# EAGLE design Robot-Controller_v11 (EAGLE 6.6.0)
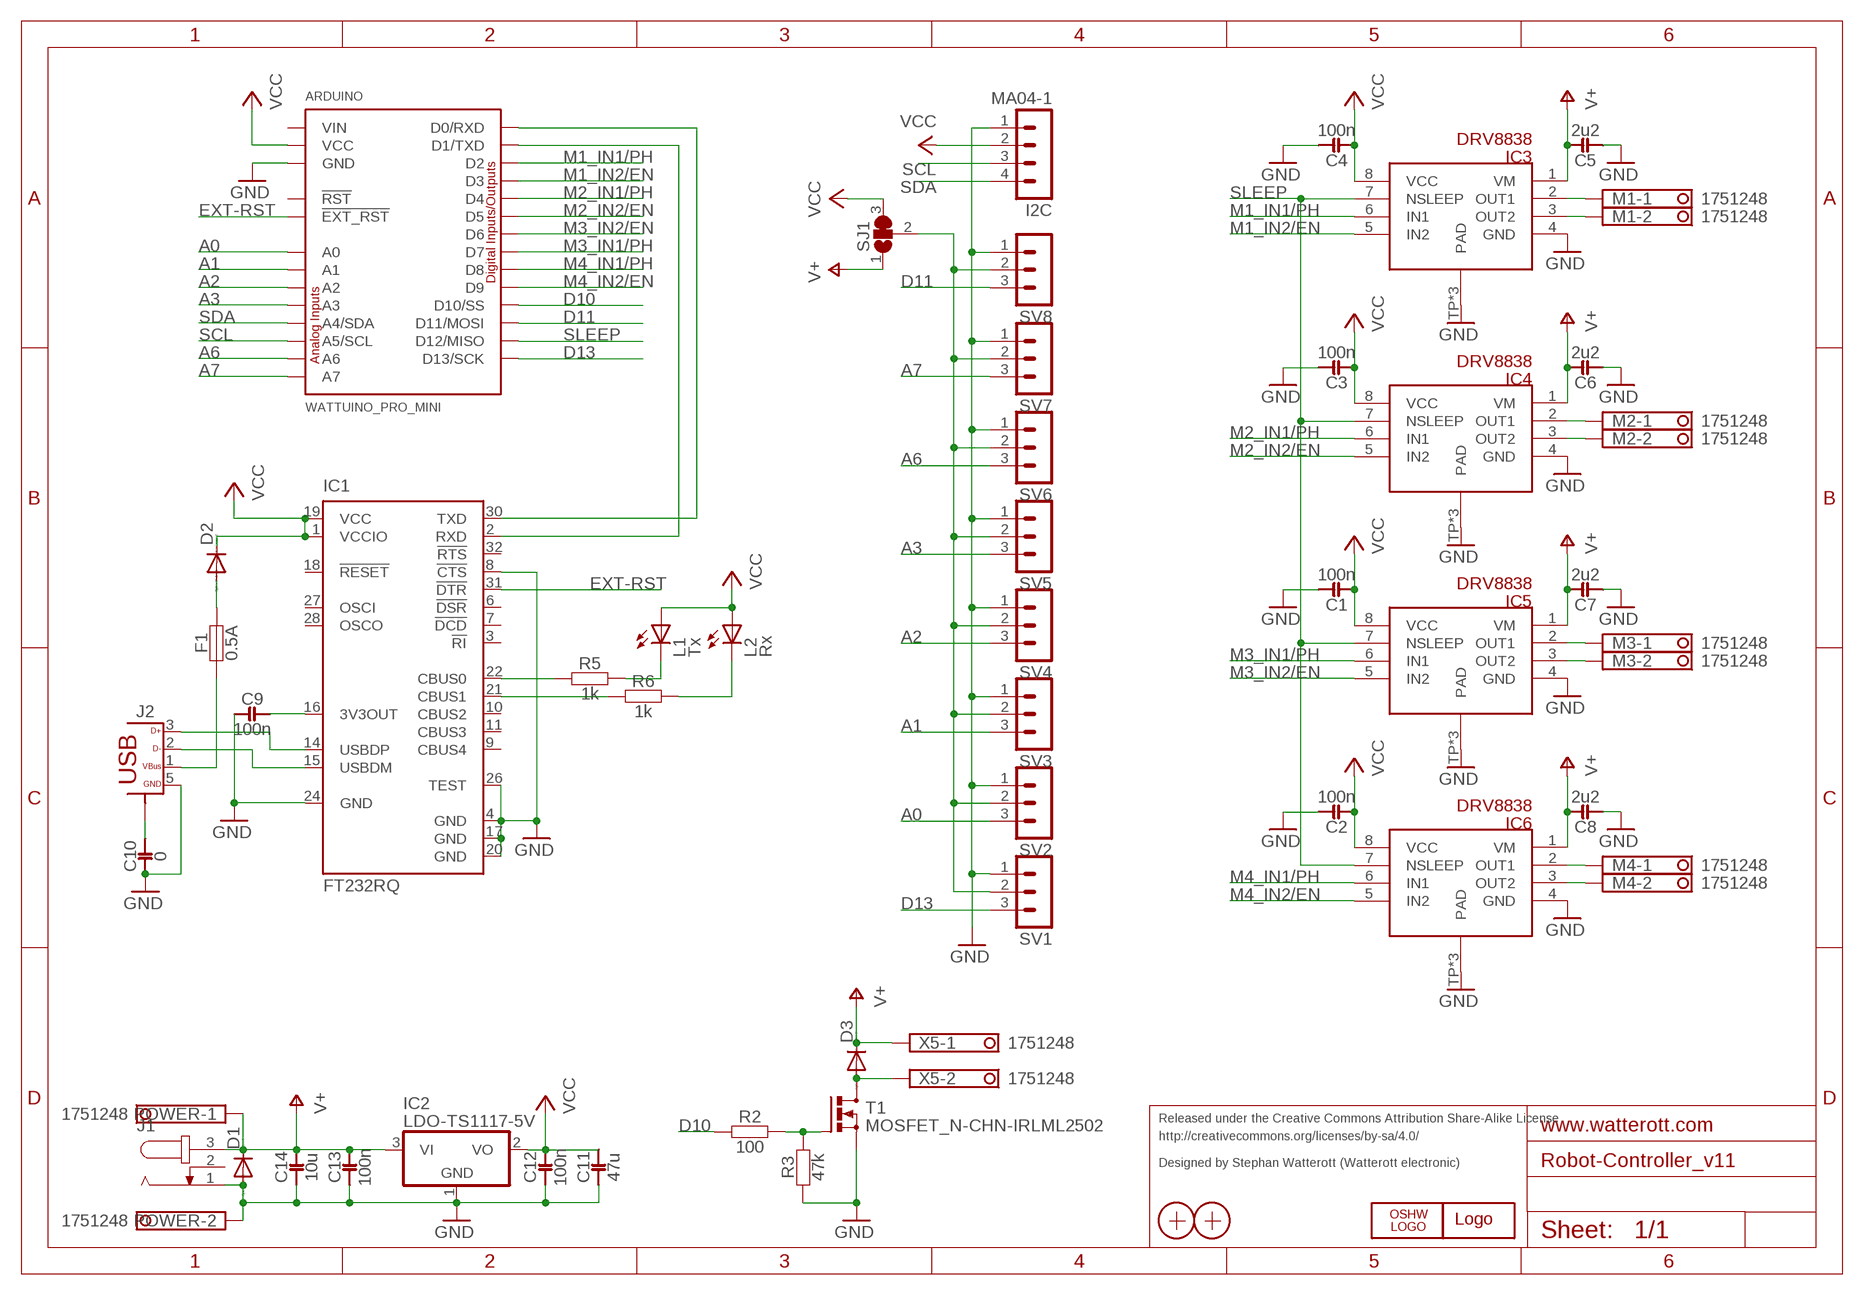
[diagram p0: schematic, sheet 1]

## Parts
ARDUINO  WATTUINO_PRO_MINI  WATTUINO_PRO_MINI5ADV1.0  [WATTUINO_PRO_MINI]
C1  100n  CAPACITOR-C0603  [R0603]
C2  100n  CAPACITOR-C0603  [R0603]
C3  100n  CAPACITOR-C0603  [R0603]
C4  100n  CAPACITOR-C0603  [R0603]
C5  2u2  CAPACITOR-C0603  [R0603]
C6  2u2  CAPACITOR-C0603  [R0603]
C7  2u2  CAPACITOR-C0603  [R0603]
C8  2u2  CAPACITOR-C0603  [R0603]
C9  100n  CAPACITOR-C0603  [R0603]
C10  0  CAPACITOR-C0603  [R0603]
C11  47u  CAPACITOR-C1206  [R1206]
C12  100n  CAPACITOR-C0603  [R0603]
C13  100n  CAPACITOR-C0603  [R0603]
C14  10u  CAPACITOR-C1206  [R1206]
D1  CGRM4001-G  [SOD-123_MINI-SMA]
D2  CGRM4001-G  [SOD-123_MINI-SMA]
D3  CGRM4001-G  [SOD-123_MINI-SMA]
F1  0.5A  RESISTOR-R0805  [R0805]
I2C  MA04-1  [MA04-1]
IC1  FT232RQ  [QFN32]
IC2  LDO-TS1117-5V  LDO-TS1117  [SOT223]
IC3  DRV8838  DRV8837  [WSON8]
IC4  DRV8838  DRV8837  [WSON8]
IC5  DRV8838  DRV8837  [WSON8]
IC6  DRV8838  DRV8837  [WSON8]
J1  DC-JACK""  [DC-JACK]
J2  USB10103594-0001LF  [10103594]
L1  Tx  LED-0603  [LED_0603]
L2  Rx  LED-0603  [LED_0603]
LOGO2  OSHW_LOGOX0100  [OSHW_6X100]
LOGO3  LOGO-SPARK_PLACE  [SPARK_TPLACE]
M1  1751248  [1751248]
M2  1751248  [1751248]
M3  1751248  [1751248]
M4  1751248  [1751248]
POWER  1751248  [1751248]
R2  100  RESISTOR-R0603  [R0603]
R3  47k  RESISTOR-R0603  [R0603]
R5  1k  RESISTOR-R0603  [R0603]
R6  1k  RESISTOR-R0603  [R0603]
SJ1  SJ2W  [SJ_2]
SV1  MA03-1  [MA03-1]
SV2  MA03-1  [MA03-1]
SV3  MA03-1  [MA03-1]
SV4  MA03-1  [MA03-1]
SV5  MA03-1  [MA03-1]
SV6  MA03-1  [MA03-1]
SV7  MA03-1  [MA03-1]
SV8  MA03-1  [MA03-1]
T1  MOSFET_N-CHN-IRLML2502  [SOT23]
X1  PASSER-07  [PASSER_07MM]
X2  PASSER-07  [PASSER_07MM]
X5  1751248  [1751248]

## Nets
A0: ARDUINO.A0 SV2.3
A1: ARDUINO.A1 SV3.3
A2: ARDUINO.A2 SV4.3
A3: ARDUINO.A3 SV5.3
A6: ARDUINO.A6 SV6.3
A7: ARDUINO.A7 SV7.3
D10: ARDUINO.10(D10/SS) R2.1
D11: ARDUINO.11(D11/MOSI) SV8.3
D13: ARDUINO.13(D13/SCK) SV1.3
EXT-RST: ARDUINO.EXT_RST(!EXT_RST) IC1.31(!DTR)
GND: ARDUINO.GND@1(GND) C1.2 C2.2 C3.2 C4.2 C5.1 C6.1 C7.1 C8.1 C9.1 C10.1 C11.1 C12.1 C13.1 C14.1 D1.A I2C.1 IC1.4(GND) IC1.8(!CTS) IC1.17(GND) IC1.20(GND) IC1.24(GND) IC1.26(TEST) IC2.1(GND) IC3.4(GND) IC3.TP1(PAD) IC3.TP2(PAD) IC3.TP(PAD) IC4.4(GND) IC4.TP1(PAD) IC4.TP2(PAD) IC4.TP(PAD) IC5.4(GND) IC5.TP1(PAD) IC5.TP2(PAD) IC5.TP(PAD) IC6.4(GND) IC6.TP1(PAD) IC6.TP2(PAD) IC6.TP(PAD) J1.1 J2.5(GND) POWER.2 R3.1 SV1.1 SV2.1 SV3.1 SV4.1 SV5.1 SV6.1 SV7.1 SV8.1 T1.2(S)
M1_IN1/PH: ARDUINO.2(D2) IC3.6(IN1)
M1_IN2/EN: ARDUINO.3(D3) IC3.5(IN2)
M2_IN1/PH: ARDUINO.4(D4) IC4.6(IN1)
M2_IN2/EN: ARDUINO.5(D5) IC4.5(IN2)
M3_IN1/PH: ARDUINO.7(D7) IC5.6(IN1)
M3_IN2/EN: ARDUINO.6(D6) IC5.5(IN2)
M4_IN1/PH: ARDUINO.8(D8) IC6.6(IN1)
M4_IN2/EN: ARDUINO.9(D9) IC6.5(IN2)
N$1: IC3.2(OUT1) M1.1
N$2: IC3.3(OUT2) M1.2
N$3: IC4.2(OUT1) M2.1
N$4: IC4.3(OUT2) M2.2
N$5: IC5.2(OUT1) M3.1
N$6: IC5.3(OUT2) M3.2
N$7: IC6.2(OUT1) M4.1
N$8: IC6.3(OUT2) M4.2
N$9: F1.1 J2.1(VBUS)
N$10: IC1.15(USBDM) J2.2(D-)
N$11: R2.2 R3.2 T1.1(G)
N$12: C9.2 IC1.16(3V3OUT)
N$13: ARDUINO.RXD@1(D0/RXD) IC1.30(TXD)
N$14: D3.A T1.3(D) X5.2
N$15: IC1.14(USBDP) J2.3(D+)
N$16: ARDUINO.TXD@1(D1/TXD) IC1.2(RXD)
N$17: IC1.22(CBUS0) R5.1
N$18: IC1.21(CBUS1) R6.1
N$19: SJ1.2 SV1.2 SV2.2 SV3.2 SV4.2 SV5.2 SV6.2 SV7.2 SV8.2
N$20: C10.2 J2.P$6(SHIELD) J2.P$7(SHIELD)
N$21: D2.A F1.2
N$22: L1.C R5.2
N$23: L2.C R6.2
SCL: ARDUINO.A5(A5/SCL) I2C.3
SDA: ARDUINO.A4(A4/SDA) I2C.4
SLEEP: ARDUINO.12(D12/MISO) IC3.7(NSLEEP) IC4.7(NSLEEP) IC5.7(NSLEEP) IC6.7(NSLEEP)
V+: C5.2 C6.2 C7.2 C8.2 C13.2 C14.2 D1.C D3.C IC2.3(VI) IC3.1(VM) IC4.1(VM) IC5.1(VM) IC6.1(VM) J1.3 POWER.1 SJ1.1 X5.1
VCC: ARDUINO.VCC@1(VCC) C1.1 C2.1 C3.1 C4.1 C11.2 C12.2 D2.C I2C.2 IC1.1(VCCIO) IC1.19(VCC) IC2.2(VO) IC3.8(VCC) IC4.8(VCC) IC5.8(VCC) IC6.8(VCC) L1.A L2.A SJ1.3
Unconnected: ARDUINO.RST@1(!RST) IC1.3(!RI) IC1.6(!DSR) IC1.7(!DCD) IC1.9(CBUS4) IC1.10(CBUS2) IC1.11(CBUS3) IC1.18(!RESET) IC1.27(OSCI) IC1.28(OSCO) IC1.32(!RTS) J1.2

## Notes on the sheet
- Released under the Creative Commons Attribution Share-Alike License
- http://creativecommons.org/licenses/by-sa/4.0/
- Designed by Stephan Watterott (Watterott electronic)

## Power pins joined to a net without a drawn wire
VIN: ARDUINO.VIN

## Library data of the parts
ARDUINO = wattuino:WATTUINO_PRO_MINI: Wattuino Pro Mini Arduino compatible module, available as 5V / 16MHz <http://www.watterott.com/en/Wattuino-pro-mini-5V-16MHz> and 3.3V / 8MHz <http://www.watterott.com/en/Wattuino-pro-mini-3V3-8MHz> versions from Watterott electronic <http://www.watterott.com>. Source: https://github.com/watterott/wattuino Features Atmel AVR ATmega328P @ 16MHz or 8MHz (external resonator) Compatible with Arduino Pro Mini LC filter on AVCC of the AVR microcontroller All pins of the AVR are available (also ADC6, ADC7) USB connection off board 5V or 3V3 voltage regulator Over current protected Note to the symbol: I declared the EXT_RST pin as I/O even it is an input only. Usually this pin is unused. Declared as input only, the ERC check would complain an unconnected input in this common case. This work is licensed under a Creative Commons Attribution-ShareAlike 3.0 Unported License <http://creativecommons.org/licenses/by-sa/3.0/>. Created by Jens Bachmann; CLOCK: 16 MHz; VCC: 5 V
C1-C14 = we-rcl:CAPACITOR
D1-D3 = diode:CGRM400*-G: Molded plasitc,JEDEC SOD-123/Mini SMA Source: Comchip CGRM4001-G.pdf
F1 R2 R3 R5 R6 = we-rcl:RESISTOR
I2C = we-con:MA04-1: PIN HEADER; OC_FARNELL: unknown; OC_NEWARK: unknown
IC1 = ftdichip:FT232R: Source: http://www.ftdichip.com/Documents/DataSheets/DS_FT232R_v104.pdf; MPN: FT232RQ; OC_FARNELL: 1146033; OC_NEWARK: 91K9919
IC2 = we-power:LDO
IC3-IC6 = we-chip:DRV8837
J1 = we-power:DC-JACK
J2 = we-con:USB: USB Connectors
L1 L2 = we-opto:LED
LOGO2 = we-symbol:OSHW_LOGO
LOGO3 = we-symbol:LOGO
M1-M4 POWER X5 = con-phoenix-350:1751248: MKDS 1/ 2-3,5 Printklemme Nennstrom: 10 A Bemessungsspannung: 160 V Raster: 3,5 mm Polzahl: 2 Montageart: Löten Anschlussart: Schraubanschluss Anschlussrichtung vom Leiter zur Platine: 0° Source: http://eshop.phoenixcontact.com .. 1751248.pdf; OC_FARNELL: unknown; OC_NEWARK: unknown
SJ1 = jumper:SJ2W: SMD solder JUMPER
SV1-SV8 = con-lstb:MA03-1: PIN HEADER; OC_FARNELL: unknown; OC_NEWARK: unknown
T1 = we-transistor:MOSFET_N-CHN: N-Channel Power MOSFET
X1 X2 = we-symbol:PASSER

## Board
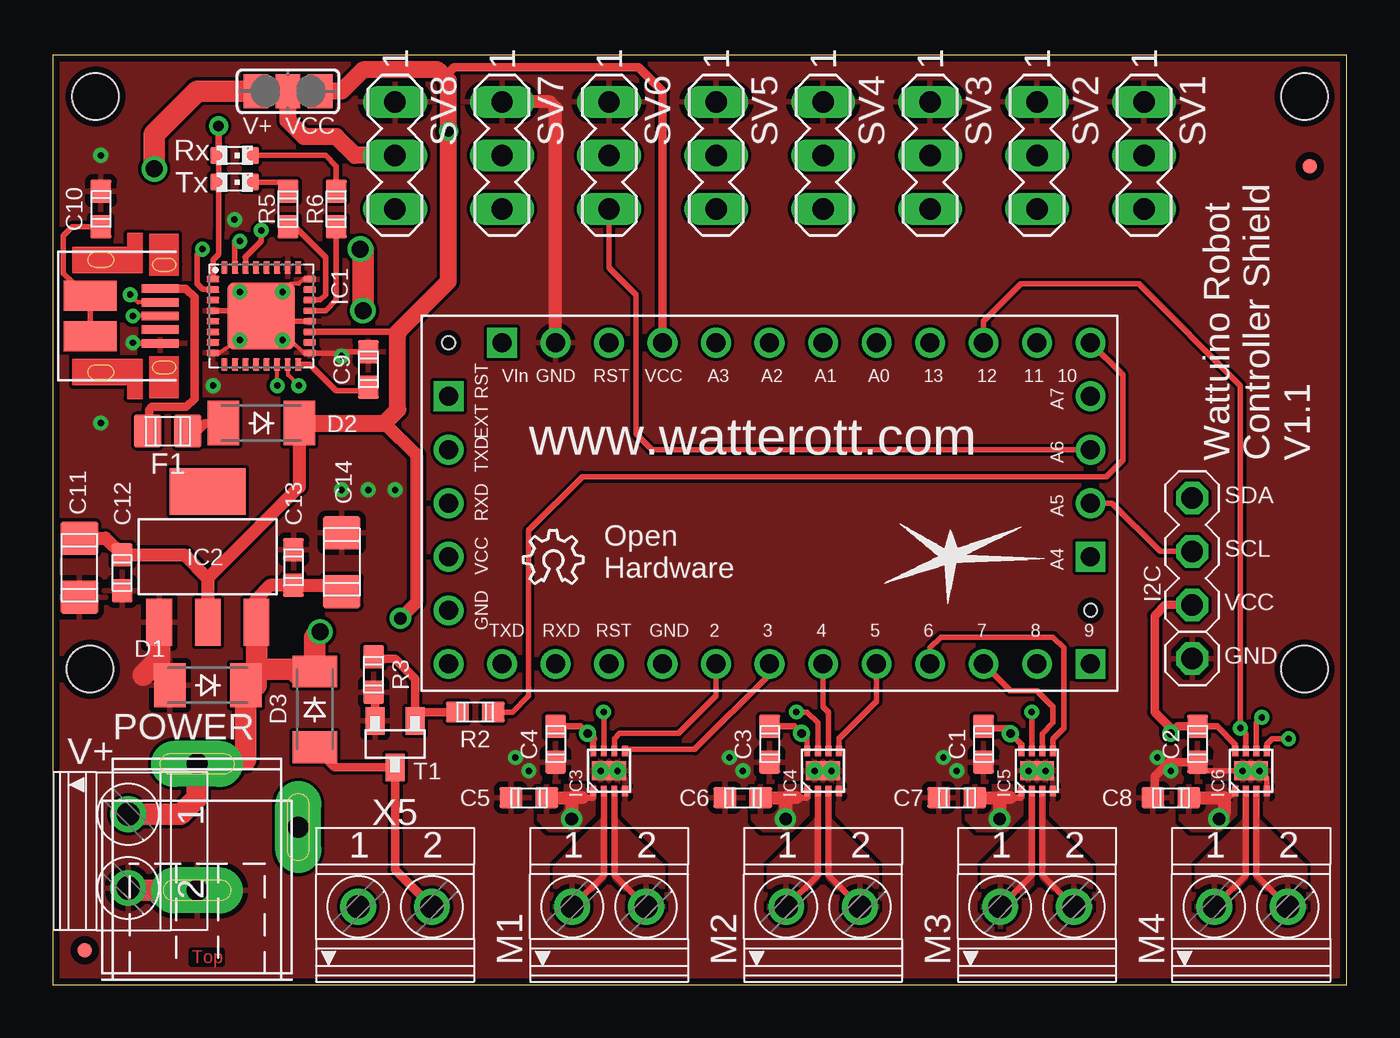
[diagram p1: board, top side]
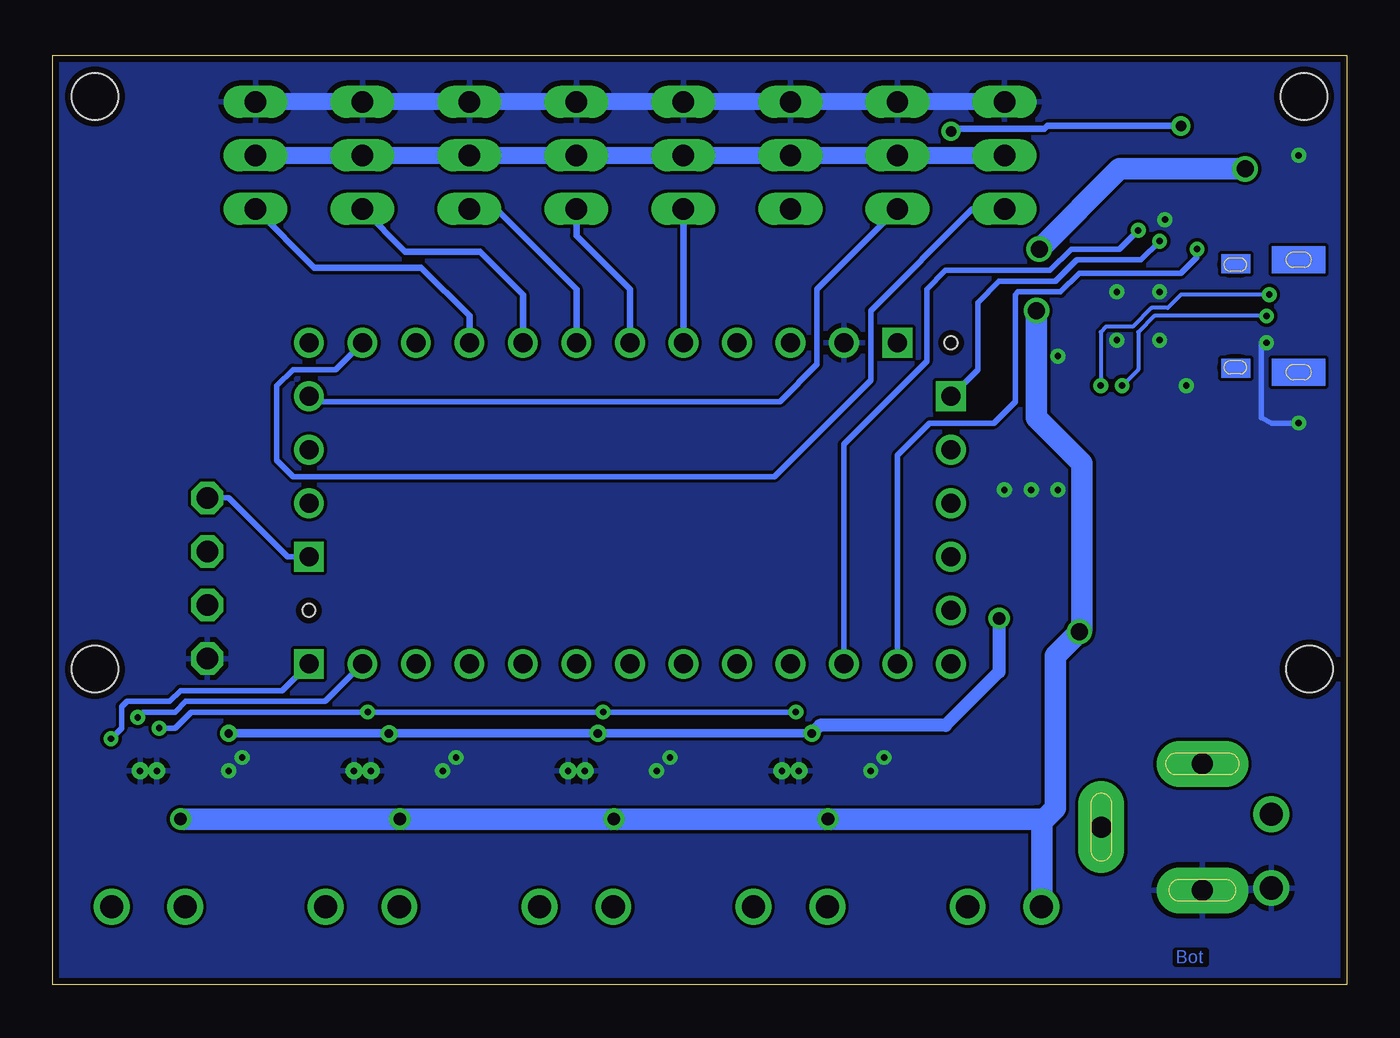
[diagram p2: board, bottom side, seen from below]

Size 61.44 x 44.12 mm. Coordinates in mm from the lower left corner, seen from the top.
Outline: 0,0 61.44,0 61.44,44.12 0,44.12 0,0
Copper layers (1*16): Top 0.035mm / dielectric 1.5mm / Bottom 0.035mm
Design rules "default *": minimum track width 6mil, minimum drill 0.29mm, track to track 6mil, track to pad 6mil, pad to pad 6mil, via to via 6mil, smd to smd 6mil, copper to edge 12mil, drill to drill 8mil, minimum pad ring 10mil, minimum via ring 8mil, stop-mask expansion 4mil, vias tented up to drill 0.8mm, thermal gap 10mil
Holes 2.2 mm at 2.03,42.16 1.78,14.99 59.44,14.99 59.44,42.16

### Footprints (pad centres in the part's own frame; a part is rotated, then mirrored left to right if it is on the bottom)
WATTUINO_PRO_MINI = drill 0.9: 2 -2.54,-7.62; 3 0,-7.62; 4 2.54,-7.62; 5 5.08,-7.62; 6 7.62,-7.62; 7 10.16,-7.62; 8 12.7,-7.62; 10 15.24,7.62; 11 12.7,7.62; 12 10.16,7.62; 13 7.62,7.62; A0 5.08,7.62; A1 2.54,7.62; A2 0,7.62; A3 -2.54,7.62; A5 15.24,0; A6 15.24,2.54; A7 15.24,5.08; GND@1 -10.16,7.62; GND@2 -5.08,-7.62; GND@3 -15.24,-7.62; GND@4 -15.24,-5.08; RST@1 -7.62,7.62; RST@2 -7.62,-7.62; RXD@1 -10.16,-7.62; RXD@2 -15.24,0; TXD@1 -12.7,-7.62; TXD@2 -15.24,2.54; VCC@1 -5.08,7.62; VCC@2 -15.24,-2.54 | drill 0.9 square: 9 15.24,-7.62; A4 15.24,-2.54; EXT_RST -15.24,5.08; VIN -12.7,7.62 | hole 0.6: -15.24,7.62; 15.24,-5.08
R0603 = smd 1 x 1.1: 1 0,0.85; 2 0,-0.85
R1206 = smd 1.8 x 1.6: 1 0,1.4; 2 0,-1.4
SOD-123_MINI-SMA = smd 1.5 x 2.1: A 1.8,0; C -1.8,0
R0805 = smd 1.55 x 1.3: 1 0,0.95; 2 0,-0.95
MA04-1 = drill 1.016 octagon: 1 0,3.81; 2 0,1.27; 3 0,-1.27; 4 0,-3.81
QFN32 = smd 0.6 x 0.3: 1 -2.3,1.75; 2 -2.3,1.25; 3 -2.3,0.75; 4 -2.3,0.25; 5 -2.3,-0.25; 6 -2.3,-0.75; 7 -2.3,-1.25; 8 -2.3,-1.75; 17 2.3,-1.75; 18 2.3,-1.25; 19 2.3,-0.75; 20 2.3,-0.25; 21 2.3,0.25; 22 2.3,0.75; 23 2.3,1.25; 24 2.3,1.75 | smd 0.3 x 0.6: 9 -1.75,-2.3; 10 -1.25,-2.3; 11 -0.75,-2.3; 12 -0.25,-2.3; 13 0.25,-2.3; 14 0.75,-2.3; 15 1.25,-2.3; 16 1.75,-2.3; 25 1.75,2.3; 26 1.25,2.3; 27 0.75,2.3; 28 0.25,2.3; 29 -0.25,2.3; 30 -0.75,2.3; 31 -1.25,2.3; 32 -1.75,2.3 | smd 3.2 x 3.2: EXP 0,0
SOT223 = smd 2.235 x 1.219: 1 -3.099,2.311; 2 -3.099,0; 3 -3.099,-2.311 | smd 2.2 x 3.6: 4 3.099,0
WSON8 = smd 0.5 x 0.28: 1 -0.95,0.75; 2 -0.95,0.25; 3 -0.95,-0.25; 4 -0.95,-0.75; 5 0.95,-0.75; 6 0.95,-0.25; 7 0.95,0.25; 8 0.95,0.75 | smd 0.9 x 1.6: TP 0,0 | drill 0.3 pad 0.61: TP1 0,0.4; TP2 0,-0.4
DC-JACK = drill 1 pad 2.184 long: 1 -3,0; 2 0,-4.8; 3 3,0
10103594 = smd 0.4 x 1.75: 1 -1.3,2.825; 2 -0.65,2.825; 3 0,2.825; 4 0.65,2.825; 5 1.3,2.825 | smd 1.425 x 2.5: P$6 0.963,-0.5; P$7 -0.963,-0.5
LED_0603 = smd 0.8 x 0.8: A 0,-0.75; C 0,0.75
1751248 = drill 1.1 pad 1.7: 1 -1.75,-0.1; 2 1.75,-0.1
SJ_2 = smd 1.168 x 1.6: 1 -1.524,0; 2 0,0; 3 1.524,0
MA03-1 = drill 1.016 long: 1 -2.54,0; 2 0,0; 3 2.54,0
SOT23 = smd 1.3 x 0.9: 1 -1.1,0.95; 2 -1.1,-0.95; 3 1.1,0
PASSER_07MM = smd 0.7 x 0.7: X 0,0

### Placement (x,y rotation side)
ARDUINO  34.04,22.86 0 top
C1  44.2,11.43 0 top
C2  54.36,11.43 0 top
C3  34.04,11.43 0 top
C4  23.88,11.43 0 top
C5  22.61,8.89 90 top
C6  32.77,8.89 90 top
C7  42.93,8.89 90 top
C8  53.09,8.89 90 top
C9  14.99,29.21 0 top
C10  2.29,36.83 0 top
C11  1.27,19.81 180 top
C12  3.3,19.56 180 top
C13  11.43,19.81 0 top
C14  13.72,20.07 0 top
D1  7.37,14.22 180 top
D2  9.91,26.67 180 top
D3  12.45,13.08 270 top
F1  5.46,26.29 90 top
I2C  54.1,19.3 180 top
IC1  9.91,31.75 0 top
IC2  7.37,20.32 90 top
IC3  26.42,10.16 90 top
IC4  36.58,10.16 90 top
IC5  46.74,10.16 90 top
IC6  56.9,10.16 90 top
J1  6.86,7.49 90 top
J2  2.29,31.75 270 top
L1  8.64,38.1 270 top
L2  8.64,39.37 270 top
LOGO2  22.35,19.05 0 top
LOGO3  42.67,20.32 0 top
M1  26.42,3.81 0 top
M2  36.58,3.81 0 top
M3  46.74,3.81 0 top
M4  56.9,3.81 0 top
POWER  3.68,6.35 270 top
R2  20.07,12.95 270 top
R3  15.24,14.73 180 top
R5  11.18,36.83 180 top
R6  13.46,36.83 180 top
SJ1  11.18,42.42 0 top
SV1  51.82,39.37 270 top
SV2  46.74,39.37 270 top
SV3  41.66,39.37 270 top
SV4  36.58,39.37 270 top
SV5  31.5,39.37 270 top
SV6  26.42,39.37 270 top
SV7  21.34,39.37 270 top
SV8  16.26,39.37 270 top
T1  16.26,11.43 270 top
X1  1.52,1.65 0 top
X2  59.69,38.86 0 top
X5  16.26,3.81 0 top

### Tracks (layer width: path | path; a pad name or v marks a point on that pad's centre or on a via)
A0
  Bottom 0.305: SV2.3 44.7,34.8 41.15,34.8 39.12,32.77 ARDUINO.A0
A1
  Bottom 0.305: SV3.3 40.39,36.83 36.58,33.02 ARDUINO.A1
A2
  Bottom 0.305: SV4.3 36.58,35.56 34.04,33.02 ARDUINO.A2
A3
  Bottom 0.305: SV5.3 ARDUINO.A3
A6
  Top 0.254: SV6.3 26.42,34.04 27.69,32.77 27.69,26.16 28.45,25.4 ARDUINO.A6
A7
  Bottom 0.254: SV7.3 25.15,33.02 25.15,29.46 26.92,27.69 49.02,27.69 ARDUINO.A7
D10
  Top 0.254: R2.1 21.84,12.95 22.61,13.72 22.61,21.59 25.15,24.13 50.04,24.13 50.8,24.89 50.8,28.96 ARDUINO.10
D11
  Bottom 0.254: SV8.3 17.78,36.83 22.61,32 22.61,28.7 27.18,24.13 50.04,24.13 50.8,24.89 50.8,28.45 50.04,29.21 48.01,29.21 ARDUINO.11
D13
  Bottom 0.305: ARDUINO.13 41.66,31.75 43.94,34.04 49.02,34.04 SV1.3 53.09,36.83
EXT-RST  (via drill 0.3)
  Top 0.254: v8.89,35.31 8.64,35.31 8.64,34.07 IC1.31
  Bottom 0.254: v8.89,35.31 9.78,34.42 12.83,34.42 13.84,33.4 16.51,33.4 17.53,32.38 17.53,29.21 ARDUINO.EXT_RST 18.8,28.32
GND  (via drill 0.3)
  Top 0.2: IC1.8 7.9,30 8.64,30.48 | IC1.24 11.91,33.5 11.68,33.27 11.3,33.27 v10.92,32.89 | 11.3,30.61 11.94,29.97 12.19,29.97
  Top 0.254: IC6.4 57.65,9.81 IC6.TP2 IC6.TP IC6.TP1 54.78,10.16 C2.2 | C9.1 13.55,30.06 13.46,29.97 12.23,29.97 IC1.17 | IC1.4 8.89,32 8.64,30.48 | 11.18,31.5 IC1.20 10.93,31.5 10.92,31.5 v10.92,30.61 11.3,30.61 | J2.5 3.59,30.45 v3.81,30.48
  Top 0.305: 12.23,29.97 12.19,29.97
  Top 0.406: C2.2 53,10.58 52.32,9.91 52.32,8.98 C8.1 | T1.2 15.31,13.87 R3.1
  Top 0.61: ARDUINO.GND@1 23.88,41.66 23.62,41.91 SV7.1
  Top 1.016: 4.3,14.71 5.08,15.49 5.08,17.2 IC2.1 | J1.1 3.69,4.49 POWER.2
  Bottom 0.254: v3.81,30.48 4.06,30.48 4.06,26.92 3.56,26.67 v2.29,26.67
  Bottom 0.813: SV8.1 SV7.1 SV6.1 SV5.1 SV4.1 SV3.1 SV2.1 SV1.1
  other vias: 13.72,23.5 14.99,23.5 16.26,23.5 32.13,10.79 32.77,10.16 22.61,10.16 21.97,10.79 42.93,10.16 42.29,10.79 53.09,10.16 52.45,10.79 13.72,29.84 8.64,36.32 2.29,39.37 7.62,28.45 8.89,30.61 8.89,32.89
  pour Top (rank 2): 0.12,0.12 61.34,0.12 61.34,43.69 0.12,43.69
  pour Bottom: 0.12,0.12 61.34,0.12 61.34,43.69 0.12,43.69
M1_IN1/PH
  Top 0.254: ARDUINO.2 31.5,13.72 29.72,11.94 26.92,11.94 26.67,11.68 IC3.6
M1_IN2/EN
  Top 0.254: ARDUINO.3 34.04,14.73 30.48,11.18 27.23,11.18 IC3.5
M2_IN1/PH
  Top 0.254: ARDUINO.4 36.58,13.21 36.83,12.95 IC4.6
M2_IN2/EN
  Top 0.254: ARDUINO.5 39.12,13.46 37.34,11.68 37.34,11.12 IC4.5
M3_IN1/PH
  Top 0.254: IC5.6 46.99,11.93 47.5,12.45 47.5,13.21 46.74,13.97 45.47,13.97 ARDUINO.7
M3_IN2/EN
  Top 0.254: IC5.5 47.49,11.67 48.01,12.19 48.01,16 47.5,16.51 42.16,16.51 41.66,16 ARDUINO.6
M4_IN1/PH  (via drill 0.3)
  Top 0.254: IC6.6 57.15,12.44 v57.4,12.7
  Bottom 0.254: ARDUINO.8 48.51,13.46 55.12,13.46 55.63,12.95 57.15,12.95 v57.4,12.7
M4_IN2/EN  (via drill 0.3)
  Top 0.254: IC6.5 57.65,11.42 57.91,11.68 v58.67,11.68
  Bottom 0.254: ARDUINO.9 50.55,13.97 55.37,13.97 55.88,13.46 57.91,13.46 58.17,13.21 58.17,12.19 v58.67,11.68
N$1
  Top 0.305: IC3.2 26.17,5.21 M1.1
  pour Top: 26.16,7.87 23.88,5.59 23.88,3.3 24.13,3.05 25.15,3.05 25.4,3.3 25.4,4.32 26.16,5.08
N$2
  Top 0.305: IC3.3 26.67,5.21 M1.2
  pour Top: 26.67,7.87 26.67,5.08 27.43,4.32 27.43,3.3 27.69,3.05 28.45,3.05 28.96,3.56 28.96,5.59
N$3
  Top 0.305: IC4.2 36.33,5.21 M2.1
  pour Top: 36.32,7.87 34.04,5.59 34.04,3.3 34.29,3.05 35.31,3.05 35.56,3.3 35.56,4.32 36.32,5.08
N$4
  Top 0.305: IC4.3 36.83,5.21 M2.2
  pour Top: 36.83,7.87 36.83,5.08 37.59,4.32 37.59,3.3 37.85,3.05 38.61,3.05 39.12,3.56 39.12,5.59
N$5
  Top 0.305: IC5.2 46.49,5.21 M3.1
  pour Top: 46.48,7.87 44.2,5.59 44.2,3.05 44.45,2.79 45.47,2.79 45.72,3.05 45.72,4.06 46.48,4.83
N$6
  Top 0.305: IC5.3 46.99,5.21 M3.2
  pour Top: 46.99,7.87 46.99,5.08 47.75,4.32 47.75,3.3 48.01,3.05 48.77,3.05 49.28,3.56 49.28,5.59
N$7
  Top 0.305: IC6.2 56.65,5.21 M4.1
  pour Top: 56.64,7.87 54.36,5.59 54.36,3.3 54.61,3.05 55.63,3.05 55.88,3.3 55.88,4.32 56.64,5.08
N$8
  Top 0.305: IC6.3 57.15,5.21 M4.2
  pour Top: 57.15,7.87 57.15,5.08 57.91,4.32 57.91,3.3 58.17,3.05 58.93,3.05 59.44,3.56 59.44,5.59
N$9
  Top 0.2: 4.57,26.35 F1.1
  Top 0.406: J2.1 6.32,33.05 6.73,32.64 6.73,27.81 6.35,27.43 4.7,27.43 4.57,27.3 4.57,26.35
N$10  (via drill 0.3)
  Top 0.2: v11.68,28.45 11.18,28.96 11.18,29.43 IC1.15 | J2.2 4.05,32.4 v3.68,32.77
  Bottom 0.2: v11.68,28.45 11.68,30.99 11.43,31.24 10.16,31.24 9.27,32.13 8.51,32.13 7.87,32.77 v3.68,32.77
N$11
  Top 0.406: R3.2 15.33,15.49 16.26,15.49 17.21,14.54 T1.1 17.63,12.95 R2.2
N$12
  Top 0.254: IC1.16 12.21,29.45 13.46,28.19 14.82,28.19 C9.2
N$13  (via drill 0.3)
  Top 0.254: v9.91,35.81 9.91,35.31 9.14,34.54 9.16,34.53 IC1.30
  Bottom 0.254: ARDUINO.RXD@1 23.88,25.65 19.94,29.59 19.94,33.02 19.05,33.91 14.1,33.91 13.08,34.92 10.79,34.92 v9.91,35.81
N$14
  Top 0.406: X5.2 16.26,5.46 T1.3 13.4,10.33 D3.A
N$15  (via drill 0.3)
  Top 0.2: J2.3 v3.81,31.75 | v10.67,28.45 10.67,29.44 IC1.14
  Bottom 0.2: v3.81,31.75 9.14,31.75 9.91,30.99 9.91,29.21 v10.67,28.45
N$16  (via drill 0.3)
  Top 0.254: IC1.2 7.59,33.02 7.11,33.02 6.86,33.27 6.86,34.67 v7.11,34.92
  Bottom 0.254: ARDUINO.TXD@1 21.34,25.15 19.81,26.67 16.76,26.67 15.75,27.69 15.75,32.77 15.62,32.89 13.59,32.89 12.7,33.78 7.87,33.78 7.11,34.54 v7.11,34.92
N$17
  Top 0.254: R5.1 11.52,35.98 12.95,34.54 12.95,32.77 12.7,32.51 12.22,32.51 IC1.22
N$18
  Top 0.254: R6.1 13.46,32.51 12.95,32 IC1.21
N$19
  Top 0.813: SV8.2 14.35,39.37 13.46,40.26 11.94,40.26 11.18,41.02 SJ1.2
  Bottom 0.813: SV1.2 SV2.2 SV3.2 SV4.2 SV5.2 SV6.2 SV7.2 SV8.2
N$20
  Top 0.254: C10.2 0.93,35.98 0.51,35.56 0.51,33.78 1.02,33.27 1.22,33.27 J2.P$7 J2.P$6
N$21
  Top 0.406: F1.2 6.86,26.29 7.24,26.67 D2.A
N$22
  Top 0.254: L1.C 10.76,38.1 R5.2
N$23
  Top 0.254: L2.C 12.95,39.37 13.46,38.86 R6.2
SCL
  Top 0.254: ARDUINO.A5 50.29,22.86 52.58,20.57 I2C.3
SDA
  Bottom 0.254: I2C.4 53.09,23.11 50.29,20.32 ARDUINO.A4
SLEEP  (via drill 0.3)
  Top 0.254: IC6.7 56.65,11.93 v56.39,12.19 56.39,28.45 51.56,33.27 45.97,33.27 44.2,31.5 ARDUINO.12 | IC5.7 v46.49,12.95 v46.48,12.95 | IC4.7 36.33,12.44 35.81,12.95 v35.31,12.95 | IC3.7 v26.17,12.95 v26.16,12.95
  Bottom 0.254: v56.39,12.19 55.63,12.19 54.86,12.95 v46.48,12.95 v35.31,12.95 v26.16,12.95
V+  (via drill 0.6, 0.8)
  Top 0.305: 55.63,8.89 55.83,8.89 IC6.1 | IC5.1 45.99,8.9 45.97,8.89 45.47,8.89 | IC4.1 35.83,8.9 35.81,8.89 35.31,8.89 | IC3.1 25.67,8.9 25.65,8.89 25.15,8.89
  Top 0.61: C8.2 55.63,8.89 55.63,8.13 v55.37,7.87 | C7.2 44.96,8.89 | 45.47,8.89 44.96,8.89 | 44.96,8.89 v44.96,7.87 | C6.2 34.8,8.89 | 35.31,8.89 34.8,8.89 | 34.8,8.89 v34.8,7.87 | C5.2 24.64,8.89 | 25.15,8.89 24.64,8.89 | 24.64,8.89 v24.64,7.87 | IC2.3 9.65,17.25 9.65,18.29 10.33,18.96 C13.2 13.42,18.96 C14.2
  Top 1.016: IC2.3 9.68,15.01 | 9.68,15.01 9.68,14.99 11.43,14.99 11.68,14.73 12.3,14.73 D3.C 12.45,16.51 v12.7,16.76 | 9.68,15.01 9.65,14.22 D1.C 9.17,10.69 7.11,10.67 6.91,10.54 J1.3 6.86,8.89 6.07,8.1 POWER.1 | SJ1.1 6.86,42.42 4.83,40.39 v4.83,38.73 | v14.61,34.92 14.73,34.92 v14.73,32
  Bottom 1.016: v55.37,7.87 v44.96,7.87 v34.8,7.87 v24.64,7.87 14.73,7.87 | 14.73,7.87 14.48,7.62 14.48,3.74 X5.1 | 14.73,7.87 14.35,7.87 13.84,8.38 13.84,15.62 v12.7,16.76 12.57,16.89 12.57,24.77 14.73,26.92 v14.73,32 | v4.83,38.73 10.79,38.73 v14.61,34.92
  pour Top: 23.11,9.4 25.65,9.4 25.65,8.13 24.89,7.37 23.62,7.37 23.11,7.87
  pour Top: 33.27,9.4 35.81,9.4 35.81,8.13 35.05,7.37 33.78,7.37 33.27,7.87
  pour Top: 43.43,9.4 45.97,9.4 45.97,8.13 45.21,7.37 43.94,7.37 43.43,7.87
  pour Top: 53.59,9.4 56.13,9.4 56.13,8.13 55.37,7.37 54.1,7.37 53.59,7.87
VCC  (via drill 0.4, 0.5, 0.6)
  Top 0.254: IC1.1 7.62,33.51 7.62,34.42 7.87,34.67 7.87,35.81 7.89,35.83 L1.A L2.A | 35.81,11.12 35.81,11.68 v35.56,11.94 35.22,12.28
  Top 0.305: IC6.8 56.13,11.12 56.13,11.43 55.28,12.28 C2.1 | C3.1 35.22,12.28 | 35.81,11.12 IC4.8 | C1.1 44.28,12.19 45.47,12.19 v45.48,11.93 45.99,11.42 IC5.8 | C4.1 25.06,12.28 v25.4,11.94 | 25.65,11.68 25.65,11.12 IC3.8 | IC1.19 16.24,31 16.38,30.86 | L2.A 7.89,40.76 v7.87,40.77
  Top 0.406: C2.1 53.43,12.28 v53.09,11.94 53.09,12.19 52.32,12.95 52.32,17.53 52.83,18.03 I2C.2 | 25.65,11.68 v25.4,11.94 | ARDUINO.VCC@1 28.96,42.42 27.81,43.56 19.05,43.56 18.67,43.18 18.54,43.18
  Top 0.61: 7.37,19.3 6.26,20.41 C12.2 2.5,21.21 C11.2 | 7.37,19.3 IC2.2 | D2.C 11.71,23.64 7.37,19.3 | 15.75,26.67 17.27,25.15 17.27,18.16 v16.51,17.4
  Top 0.813: D2.C 15.75,26.67 16.38,27.3 16.38,30.86 16.38,30.99 18.8,33.4 v18.8,40.51 18.8,42.93 18.54,43.18 18.29,43.43 14.73,43.43 13.72,42.42 SJ1.3
  Bottom 0.254: 45.21,11.94 45.22,11.93 v45.48,11.93 45.49,11.94
  Bottom 0.305: v7.87,40.77 14.22,40.77 14.35,40.64 18.67,40.64 v18.8,40.51
  Bottom 0.406: v53.09,11.94 45.49,11.94 | v45.47,11.94 45.21,11.94 v35.56,11.94 v25.4,11.94
  Bottom 0.61: v16.51,17.4 16.51,14.86 19.05,12.32 25.02,12.32 v25.4,11.94

### Text on the board
Top: Top
Bottom: Bot
tPlace: V+ VCC | www.watterott.com | Wattuino Robot / Controller Shield / V1.1 | SDA | Open | SCL | Hardware | VCC | GND | V+
Reference: Silkscreen: 21 tPlace + 25 tNames